# Altium schematic sheet 1x9x1.SchDoc
size A; SheetNumber: 1; SheetTotal: 3
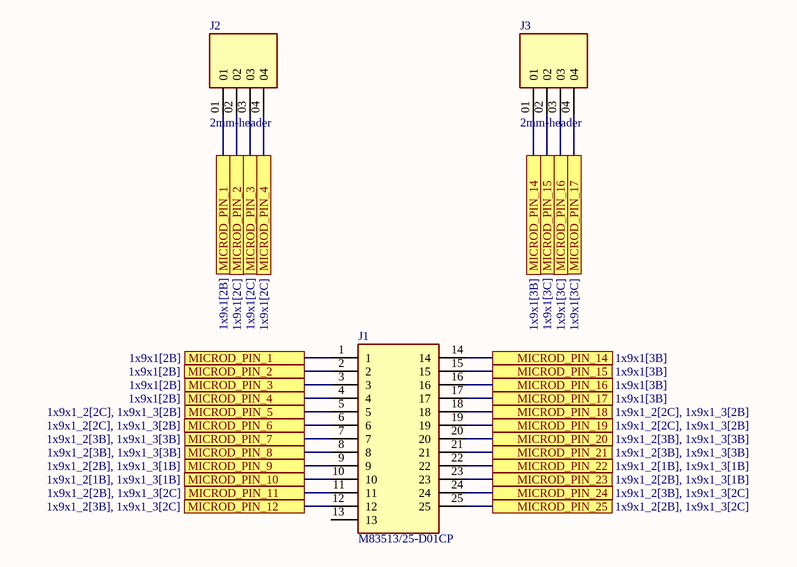
[diagram p0: 1x9x1.SchDoc]

## Parts
J1  M83513/25-D01CP  [BEL_M83513/25-D01CP]
J2  2mm-header  [2mm-header]
J3  2mm-header  [2mm-header]

## Ports
MICROD_PIN_1 (see 1x9x1[2B]), MICROD_PIN_2 (see 1x9x1[2B]), MICROD_PIN_2 (see 1x9x1[2C]), MICROD_PIN_3 (see 1x9x1[2B]), MICROD_PIN_3 (see 1x9x1[2C]), MICROD_PIN_4 (see 1x9x1[2B]), MICROD_PIN_4 (see 1x9x1[2C]), MICROD_PIN_5 (see 1x9x1_2[2C], 1x9x1_3[2B]), MICROD_PIN_6 (see 1x9x1_2[2C], 1x9x1_3[2B]), MICROD_PIN_7 (see 1x9x1_2[3B], 1x9x1_3[3B]), MICROD_PIN_8 (see 1x9x1_2[3B], 1x9x1_3[3B]), MICROD_PIN_9 (see 1x9x1_2[2B], 1x9x1_3[1B]), MICROD_PIN_10 (see 1x9x1_2[1B], 1x9x1_3[1B]), MICROD_PIN_11 (see 1x9x1_2[2B], 1x9x1_3[2C]), MICROD_PIN_12 (see 1x9x1_2[3B], 1x9x1_3[2C]), MICROD_PIN_14 (see 1x9x1[3B]), MICROD_PIN_15 (see 1x9x1[3B]), MICROD_PIN_15 (see 1x9x1[3C]), MICROD_PIN_16 (see 1x9x1[3B]), MICROD_PIN_16 (see 1x9x1[3C]), MICROD_PIN_17 (see 1x9x1[3B]), MICROD_PIN_17 (see 1x9x1[3C]), MICROD_PIN_18 (see 1x9x1_2[2C], 1x9x1_3[2B]), MICROD_PIN_19 (see 1x9x1_2[2C], 1x9x1_3[2B]), MICROD_PIN_20 (see 1x9x1_2[3B], 1x9x1_3[3B]), MICROD_PIN_21 (see 1x9x1_2[3B], 1x9x1_3[3B]), MICROD_PIN_22 (see 1x9x1_2[1B], 1x9x1_3[1B]), MICROD_PIN_23 (see 1x9x1_2[2B], 1x9x1_3[1B]), MICROD_PIN_24 (see 1x9x1_2[3B], 1x9x1_3[2C]), MICROD_PIN_25 (see 1x9x1_2[2B], 1x9x1_3[2C])

## Nets
MICROD_PIN_1: J1.1 J2.01 ; port MICROD_PIN_1
MICROD_PIN_2: J1.2 J2.02 ; port MICROD_PIN_2
MICROD_PIN_3: J1.3 J2.03 ; port MICROD_PIN_3
MICROD_PIN_4: J1.4 J2.04 ; port MICROD_PIN_4
MICROD_PIN_5: J1.5 ; port MICROD_PIN_5
MICROD_PIN_6: J1.6 ; port MICROD_PIN_6
MICROD_PIN_7: J1.7 ; port MICROD_PIN_7
MICROD_PIN_8: J1.8 ; port MICROD_PIN_8
MICROD_PIN_9: J1.9 ; port MICROD_PIN_9
MICROD_PIN_10: J1.10 ; port MICROD_PIN_10
MICROD_PIN_11: J1.11 ; port MICROD_PIN_11
MICROD_PIN_12: J1.12 ; port MICROD_PIN_12
MICROD_PIN_14: J1.14 J3.01 ; port MICROD_PIN_14
MICROD_PIN_15: J1.15 J3.02 ; port MICROD_PIN_15
MICROD_PIN_16: J1.16 J3.03 ; port MICROD_PIN_16
MICROD_PIN_17: J1.17 J3.04 ; port MICROD_PIN_17
MICROD_PIN_18: J1.18 ; port MICROD_PIN_18
MICROD_PIN_19: J1.19 ; port MICROD_PIN_19
MICROD_PIN_20: J1.20 ; port MICROD_PIN_20
MICROD_PIN_21: J1.21 ; port MICROD_PIN_21
MICROD_PIN_22: J1.22 ; port MICROD_PIN_22
MICROD_PIN_23: J1.23 ; port MICROD_PIN_23
MICROD_PIN_24: J1.24 ; port MICROD_PIN_24
MICROD_PIN_25: J1.25 ; port MICROD_PIN_25

Not connected (* = marked no-connect by the designer): J1 13

## Library data of the parts
J1 = M83513/25-D01CP: MIL-DTL-83513 PCB Mounted Connector | Socket | 25 Positions | Shell Finish - Cadmium | Female | PCB Solder Pins | 0.109" (2.77 mm) Pin Length; Package: None; Price: None; Value: *; MP: M83513/25-D01CP; Availability: Unavailable
J2 J3 = 2mm-header: <a href="https://pricing.snapeda.com/parts/TSW-104-07-G-S/Samtec/view-part?ref=eda">Check availability</a>; MP: altium_native_batch; Package: None; Price: None; Value: *; Availability: Unavailable